# Altium project esp32_c6_a1.PrjPcb
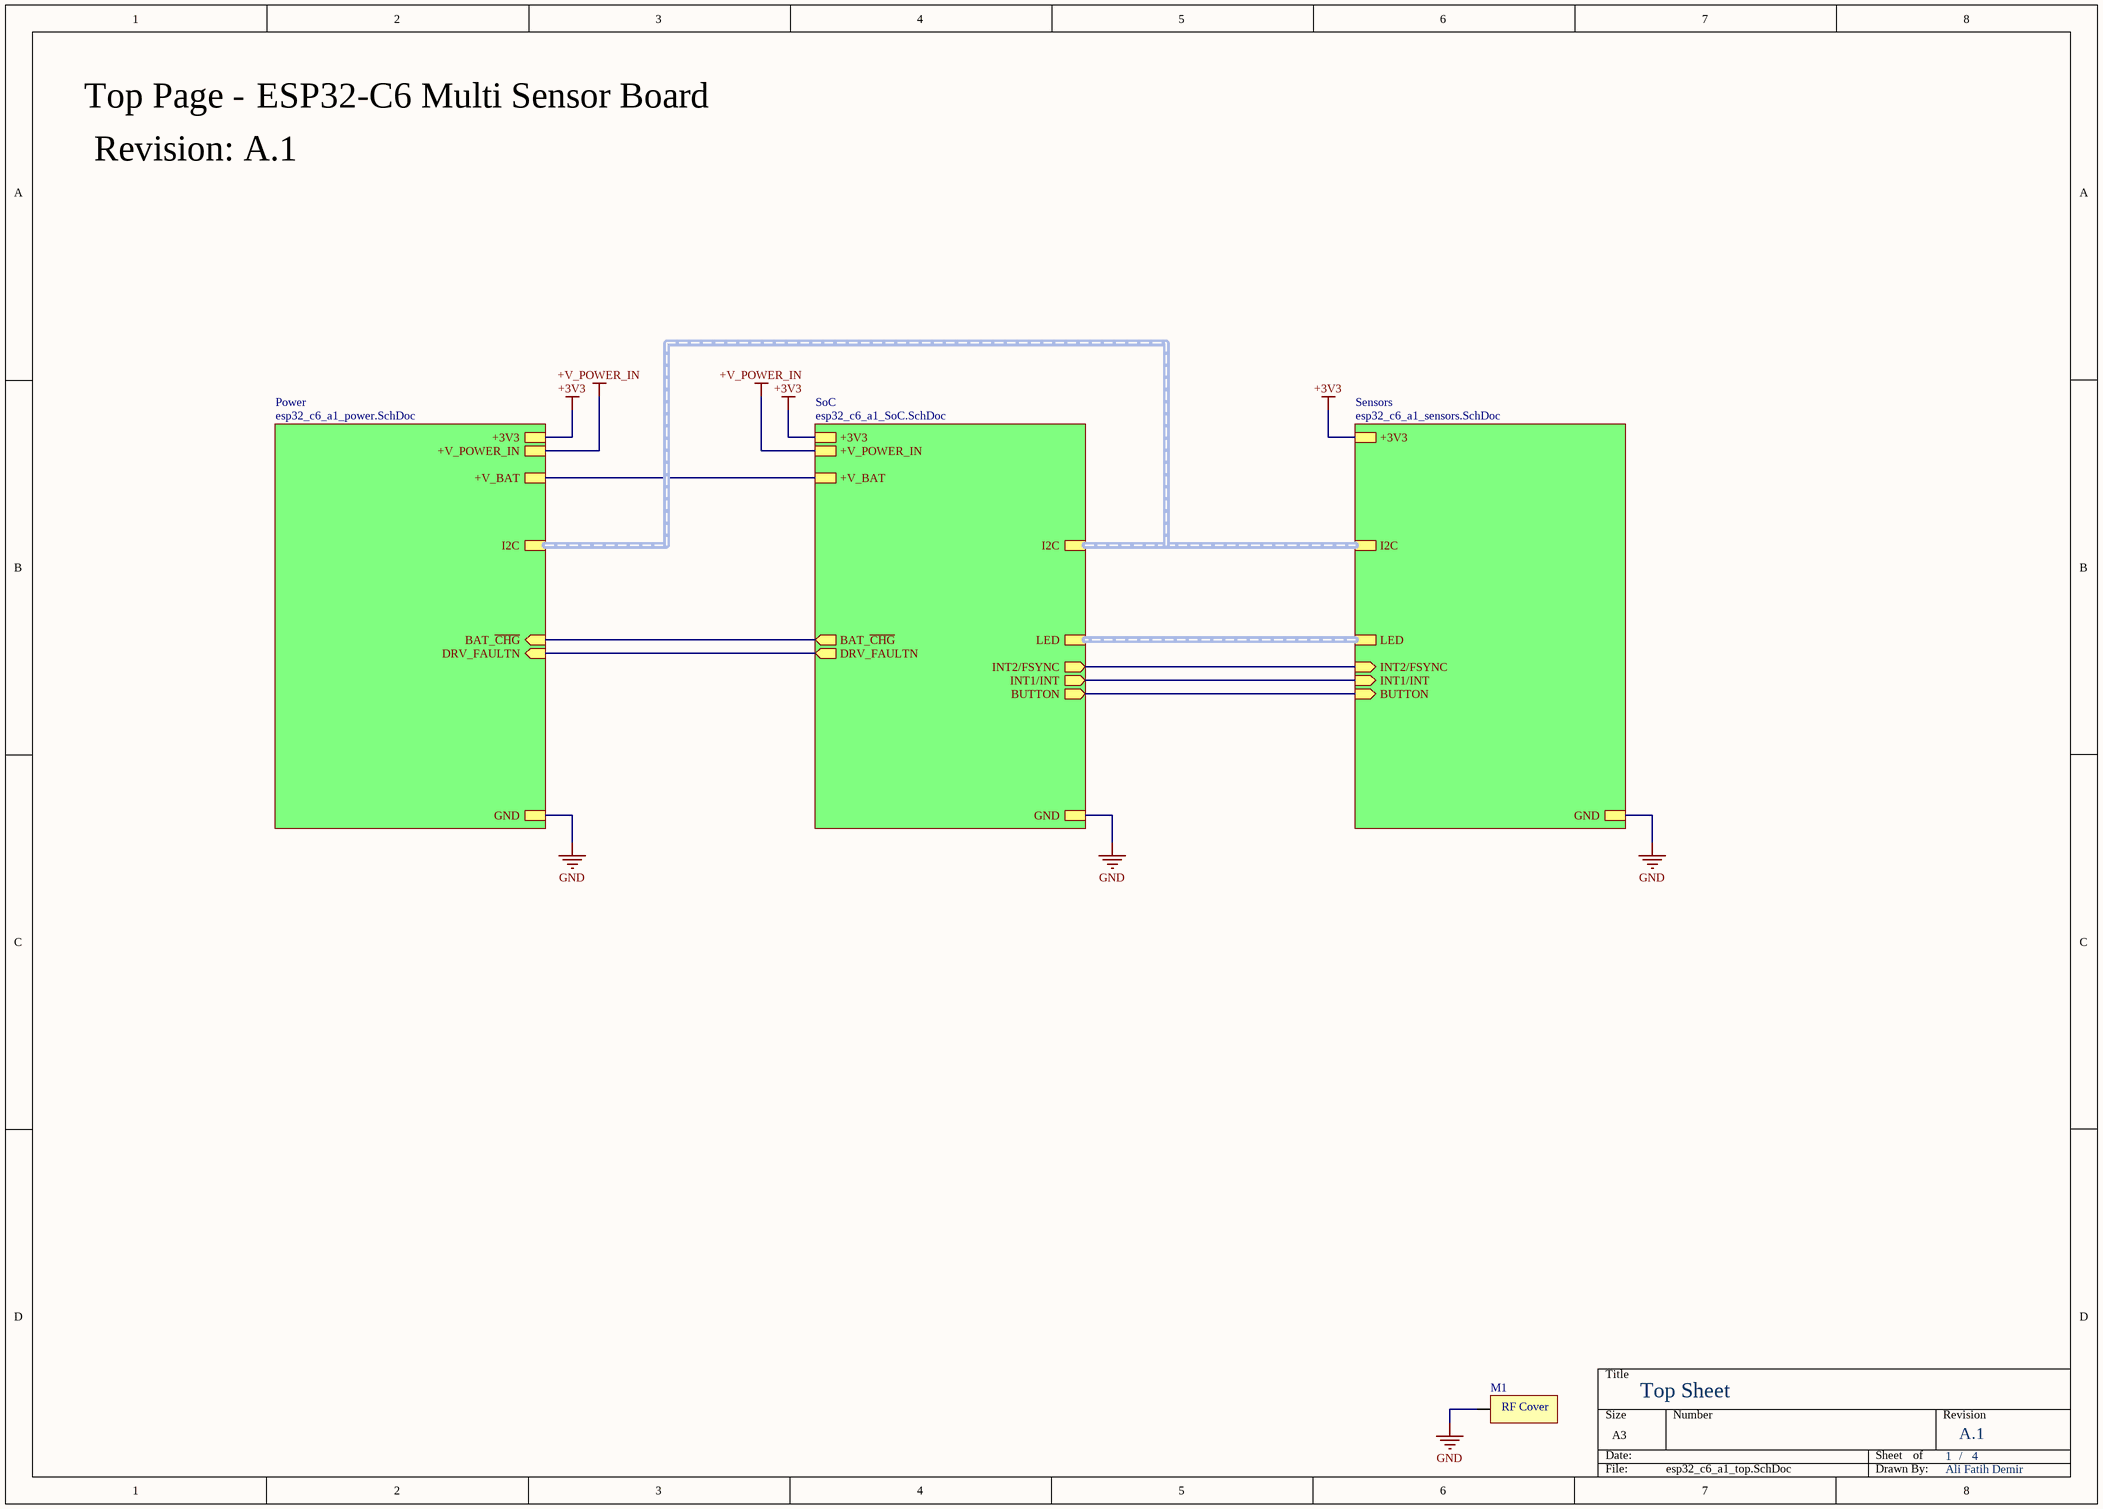
[diagram p0: esp32_c6_a1_top.SchDoc]
pcb_designer: Ali Fatih Demir; project_title: ESP32-C6 Multi Sensor Board; Revision: A.1; sch_designer: Ali Fatih Demir
4 sheets, 111 parts. Net scope: strictly hierarchical (ports join the sheet entries above them; power ports are local).
Board file: esp32_c6_a1.PcbDoc
Sheets:
  esp32_c6_a1_top.SchDoc
    SoC = esp32_c6_a1_SoC.SchDoc
    Power = esp32_c6_a1_power.SchDoc
    Sensors = esp32_c6_a1_sensors.SchDoc

## Sheet esp32_c6_a1_top.SchDoc: Top Sheet
size A3; DrawnBy: Ali Fatih Demir; SheetNumber: 1; SheetTotal: 4

### Parts
M1  RF_COVER  [rf-cover]  (value not drawn)

### Sub-sheets
Power = esp32_c6_a1_power.SchDoc: I2C (harness I2C), +V_BAT, GND, BAT_~{CHG} (in), DRV_FAULTN (in), +3V3, +V_POWER_IN
Sensors = esp32_c6_a1_sensors.SchDoc: +3V3, I2C (harness I2C), GND, LED (harness LED), INT2/FSYNC (in), INT1/INT (in), BUTTON (in)
SoC = esp32_c6_a1_SoC.SchDoc: +V_BAT, GND, BAT_~{CHG} (out), DRV_FAULTN (out), +3V3, LED (harness LED), INT2/FSYNC (out), INT1/INT (out), BUTTON (out), I2C (harness I2C), +V_POWER_IN

### Nets
+3V3: sheet SoC/+3V3, sheet Power/+3V3, sheet Sensors/+3V3
+V_BAT: sheet SoC/+V_BAT, sheet Power/+V_BAT
+V_POWER_IN: sheet SoC/+V_POWER_IN, sheet Power/+V_POWER_IN
GND: M1.MH0(MH) ; sheet SoC/GND, sheet Power/GND, sheet Sensors/GND
BAT_~{CHG}: sheet SoC/BAT_~{CHG}, sheet Power/BAT_~{CHG}
BUTTON: sheet SoC/BUTTON, sheet Sensors/BUTTON
DRV_FAULTN: sheet SoC/DRV_FAULTN, sheet Power/DRV_FAULTN
ICM_INT1/INT: sheet SoC/INT1/INT, sheet Sensors/INT1/INT
ICM_INT2/FSYNC: sheet SoC/INT2/FSYNC, sheet Sensors/INT2/FSYNC

### Buses and harness runs
harness sheet Power/I2C = sheet Sensors/I2C = sheet SoC/I2C
harness sheet Sensors/LED = sheet SoC/LED

### Notes on the sheet
- Top Page -
- Revision:
- /

### Library data of the parts
M1 = RF_COVER: RF Cover; pin to pad: MH0>MH0+MH1+MH2+MH3+MH4; Manufacturer: TBD; MPN: TBD

## Sheet esp32_c6_a1_SoC.SchDoc
size A3; SheetNumber: 2; SheetTotal: 4
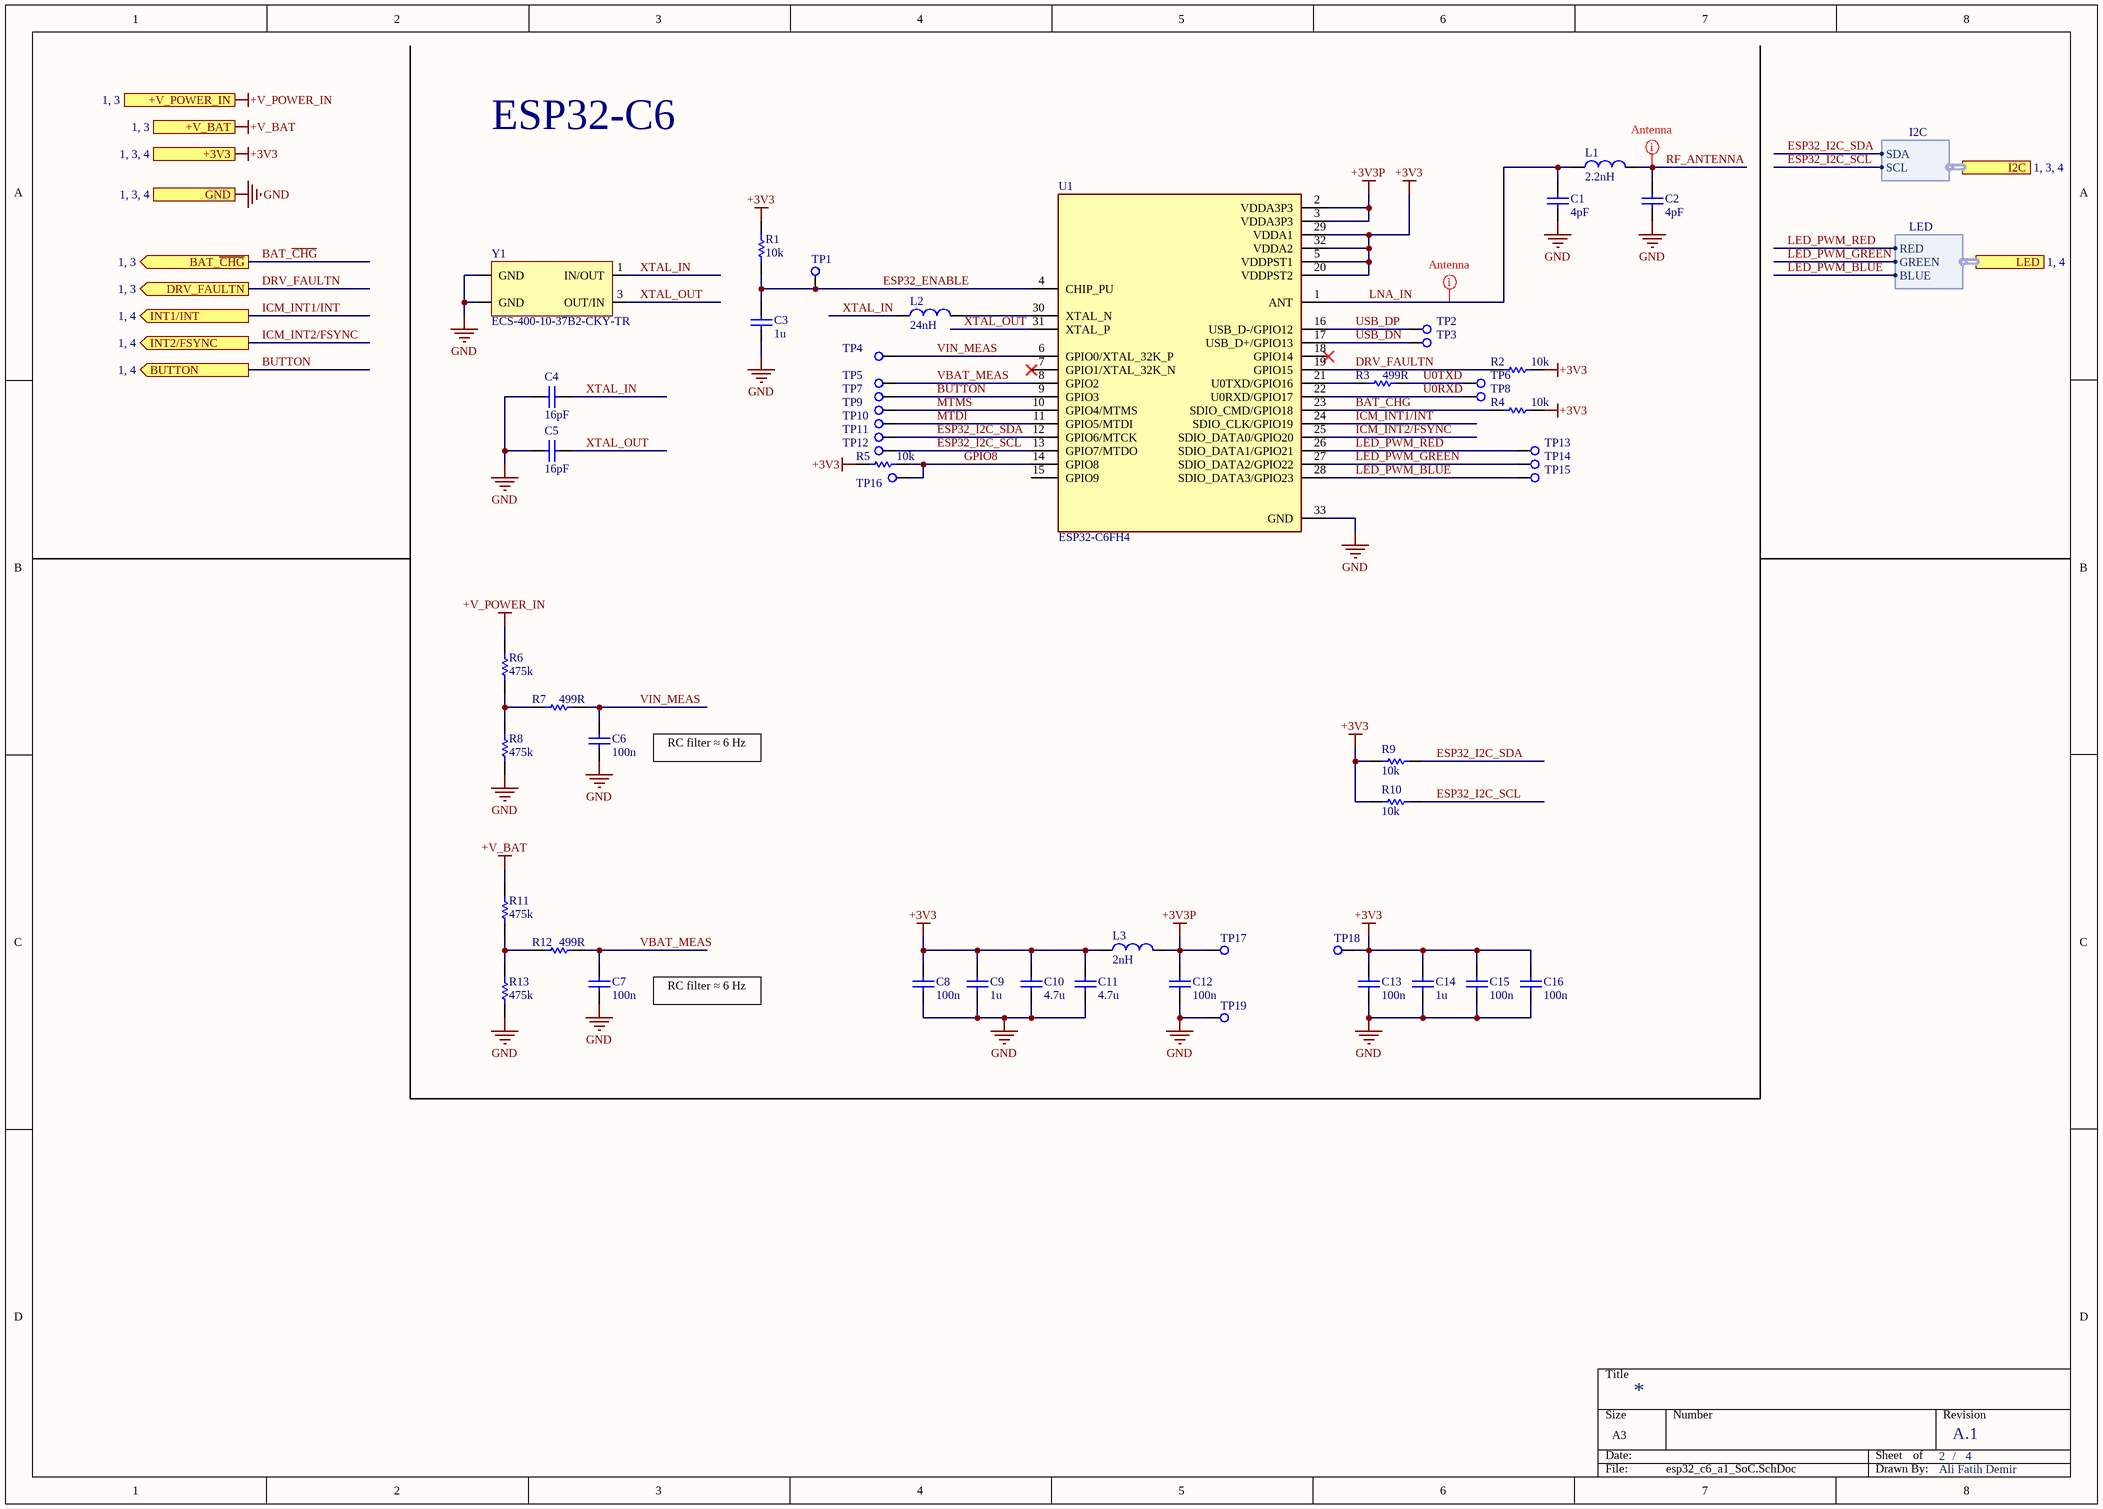
[diagram p1: esp32_c6_a1_SoC.SchDoc]

### Parts
C1  value 4pF  [C_0201]  (hidden comment: 0201)
C2  value 4pF  [C_0201]  (hidden comment: 0201)
C3  value 1u  [C_0603]  (hidden comment: 0603)
C4  value 16pF  [C_0402]  (hidden comment: 0402)
C5  value 16pF  [C_0402]  (hidden comment: 0402)
C6  value 100n  [C_0402]  (hidden comment: 0402)
C7  value 100n  [C_0402]  (hidden comment: 0402)
C8  value 100n  [C_0402]  (hidden comment: 0402)
C9  value 1u  [C_0603]  (hidden comment: 0603)
C10  value 4.7u  [C_0603]  (hidden comment: 0603)
C11  value 4.7u  [C_0603]  (hidden comment: 0603)
C12  value 100n  [C_0402]  (hidden comment: 0402)
C13  value 100n  [C_0402]  (hidden comment: 0402)
C14  value 1u  [C_0603]  (hidden comment: 0603)
C15  value 100n  [C_0402]  (hidden comment: 0402)
C16  value 100n  [C_0402]  (hidden comment: 0402)
L1  value 2.2nH  [L_0201]  (hidden comment: 0201)
L2  value 24nH  [L_0201]  (hidden comment: 0201)
L3  value 2nH  [L_0402]  (hidden comment: 0402)
R1  value 10k  [R_0402]  (hidden comment: 0402)
R2  value 10k  [R_0402]  (hidden comment: 0402)
R3  value 499R  [R_0402]  (hidden comment: 0402)
R4  value 10k  [R_0402]  (hidden comment: 0402)
R5  value 10k  [R_0402]  (hidden comment: 0402)
R6  value 475k  [R_0402]  (hidden comment: 0402)
R7  value 499R  [R_0402]  (hidden comment: 0402)
R8  value 475k  [R_0402]  (hidden comment: 0402)
R9  value 10k  [R_0402]  (hidden comment: 0402)
R10  value 10k  [R_0402]  (hidden comment: 0402)
R11  value 475k  [R_0402]  (hidden comment: 0402)
R12  value 499R  [R_0402]  (hidden comment: 0402)
R13  value 475k  [R_0402]  (hidden comment: 0402)
TP1  TP  [tp_round_80]  (value not drawn)  (no BOM)
TP2  TP  [tp_round_80]  (value not drawn)  (no BOM)
TP3  TP  [tp_round_80]  (value not drawn)  (no BOM)
TP4  TP  [tp_round_80]  (value not drawn)  (no BOM)
TP5  TP  [tp_round_80]  (value not drawn)  (no BOM)
TP6  TP  [tp_round_80]  (value not drawn)  (no BOM)
TP7  TP  [tp_round_80]  (value not drawn)  (no BOM)
TP8  TP  [tp_round_80]  (value not drawn)  (no BOM)
TP9  TP  [tp_round_80]  (value not drawn)  (no BOM)
TP10  TP  [tp_round_80]  (value not drawn)  (no BOM)
TP11  TP  [tp_round_80]  (value not drawn)  (no BOM)
TP12  TP  [tp_round_80]  (value not drawn)  (no BOM)
TP13  TP  [tp_round_80]  (value not drawn)  (no BOM)
TP14  TP  [tp_round_80]  (value not drawn)  (no BOM)
TP15  TP  [tp_round_80]  (value not drawn)  (no BOM)
TP16  TP  [tp_round_80]  (value not drawn)  (no BOM)
TP17  TP  [tp_round_80]  (value not drawn)  (no BOM)
TP18  TP  [tp_round_80]  (value not drawn)  (no BOM)
TP19  TP  [tp_round_80]  (value not drawn)  (no BOM)
U1  ESP32-C6FH4  [QFN50P500X500X90-33N]
Y1  ECS-400-10-37B2-CKY-TR  [XTAL_ECS-400-10-37B2-CKY-TR]

### Ports
+3V3 (see 1, 3, 4), +V_BAT (see 1, 3), +V_POWER_IN (see 1, 3), BAT_~{CHG} (out, see 1, 3), BUTTON (out, see 1, 4), DRV_FAULTN (out, see 1, 3), GND (see 1, 3, 4), I2C (harness I2C, see 1, 3, 4), INT1/INT (out, see 1, 4), INT2/FSYNC (out, see 1, 4), LED (harness LED, see 1, 4)

### Harnesses
I2C: SDA, SCL
LED: RED, GREEN, BLUE

### Nets
+3V3: C8.2 C9.2 C10.2 C11.2 C13.2 C14.2 C15.2 C16.2 L3.1 R1.2 R2.2 R4.2 R5.1 R9.2 R10.2 TP18.1 U1.5(VDDPST1) U1.20(VDDPST2) U1.29(VDDA1) U1.32(VDDA2) ; port +3V3
+3V3P: C12.2 L3.2 TP17.1 U1.2(VDDA3P3) U1.3(VDDA3P3)
+V_BAT: R11.2 ; port +V_BAT
+V_POWER_IN: R6.2 ; port +V_POWER_IN
GND: C1.1 C2.1 C3.1 C4.2 C5.2 C6.1 C7.1 C8.1 C9.1 C10.1 C11.1 C12.1 C13.1 C14.1 C15.1 C16.1 R8.1 R13.1 TP19.1 U1.33(GND) Y1.2(GND) Y1.4(GND) ; port GND
BAT_~{CHG}: R4.1 U1.23(SDIO_CMD/GPIO18) ; port BAT_~{CHG}
BUTTON: TP7.1 U1.9(GPIO3) ; port BUTTON
DRV_FAULTN: R2.1 U1.19(GPIO15) ; port DRV_FAULTN
ESP32_ENABLE: C3.2 R1.1 TP1.1 U1.4(CHIP_PU)
ESP32_I2C_SCL: R10.1 TP12.1 U1.13(GPIO7/MTDO) ; port I2C.SCL
ESP32_I2C_SDA: R9.1 TP11.1 U1.12(GPIO6/MTCK) ; port I2C.SDA
GPIO8: R5.2 TP16.1 U1.14(GPIO8)
ICM_INT1/INT: U1.24(SDIO_CLK/GPIO19) ; port INT1/INT
ICM_INT2/FSYNC: U1.25(SDIO_DATA0/GPIO20) ; port INT2/FSYNC
LED_PWM_BLUE: TP15.1 U1.28(SDIO_DATA3/GPIO23) ; port LED.BLUE
LED_PWM_GREEN: TP14.1 U1.27(SDIO_DATA2/GPIO22) ; port LED.GREEN
LED_PWM_RED: TP13.1 U1.26(SDIO_DATA1/GPIO21) ; port LED.RED
LNA_IN: C1.2 L1.1 U1.1(ANT)
MTDI: TP10.1 U1.11(GPIO5/MTDI)
MTMS: TP9.1 U1.10(GPIO4/MTMS)
RF_ANTENNA: C2.2 L1.2
U0RXD: TP8.1 U1.22(U0RXD/GPIO17)
U0TXD: R3.2 TP6.1
USB_DN: TP3.1 U1.17(USB_D+/GPIO13)
USB_DP: TP2.1 U1.16(USB_D-/GPIO12)
VBAT_MEAS: C7.2 R12.2 TP5.1 U1.8(GPIO2)
VIN_MEAS: C6.2 R7.2 TP4.1 U1.6(GPIO0/XTAL_32K_P)
XTAL_IN: C4.1 L2.1 Y1.1(IN/OUT)
XTAL_OUT: C5.1 U1.31(XTAL_P) Y1.3(OUT/IN)
NetL2_2: L2.2 U1.30(XTAL_N)
NetR3_1: R3.1 U1.21(U0TXD/GPIO16)
NetR6_1: R6.1 R7.1 R8.2
NetR11_1: R11.1 R12.1 R13.2

Not connected (* = marked no-connect by the designer): U1 7(GPIO1/XTAL_32K_N)* 15(GPIO9) 18(GPIO14)*

### Layout directives
net class Antenna: LNA_IN, RF_ANTENNA

### Notes on the sheet
- ESP32-C6
- The crystal should operate flawlessly to maximize RF performance. Please verify this again using Espressif's test software.
- RC filter ≈ 6 Hz
- /

### Library data of the parts
C1 C2 = C_0201: SMD 0201 Ceramic Chip Capacitor; Manufacturer: Murata; MPN: GRM0335C1H4R0BA01D; Cad Data: ?; Part Number: ?; List Code: ?
C3 C9 C14 = C_0603: SMD 0603 Ceramic Chip Capacitor; Manufacturer: Samsung; MPN: CL10B105KP8NNNC; Cad Data: ?; Part Number: ?; List Code: ?
C4 C5 = C_0402: SMD 0402 Ceramic Chip Capacitor; Manufacturer: Murata; MPN: GJM1555C1H160FB01J; Cad Data: ?; Part Number: ?; List Code: ?
C6-C8 C12 C13 C15 C16 = C_0402: SMD 0402 Ceramic Chip Capacitor; Manufacturer: Samsung; MPN: CL05B104KP5NNNC; Cad Data: ?; Part Number: ?; List Code: ?
C10 C11 = C_0603: SMD 0603 Ceramic Chip Capacitor; Manufacturer: Samsung; MPN: CL10A475KP8NNNC; Cad Data: ?; Part Number: ?; List Code: ?
L1 = L_0201: SMD 0201 Inductor; Manufacturer: Murata; MPN: LQP03TN2N2B02D; Cad Data: ?; Part Number: ?; List Code: ?
L2 = L_0201: SMD 0201 Inductor; Manufacturer: Murata; MPN: LQP03TN24NH02D; Cad Data: ?; Part Number: ?; List Code: ?
L3 = L_0402: SMD 0402 Inductor; Manufacturer: Murata; MPN: LQG15HN2N0C02D; Cad Data: ?; Part Number: ?; List Code: ?
R1 R2 R4 R5 R9 R10 = R_0402: SMD 0402 Rectangular Thick Film Chip Resistor; Manufacturer: Yageo; MPN: RC0402FR-0710KL; Cad Data: ?; Part Number: ?; List Code: ?
R3 R7 R12 = R_0402: SMD 0402 Rectangular Thick Film Chip Resistor; Manufacturer: Yageo; MPN: RC0402FR-07499RL; Cad Data: ?; Part Number: ?; List Code: ?
R6 R8 R11 R13 = R_0402: SMD 0402 Rectangular Thick Film Chip Resistor; Manufacturer: Yageo; MPN: RC0402FR-07475KL; Cad Data: ?; Part Number: ?; List Code: ?
TP1-TP19 = TP: Test Point
U1 = ESP32-C6FH4: 802.15.4, Bluetooth, WiFi 802.11ax, Bluetooth v5.0, ZigbeeÂ® Transceiver Module 2.4GHz Antenna Not Included Surface Mount; Manufacturer: Espressif Systems; Package: None; Price: None; Check_prices: https://www.snapeda.com/parts/ESP32-C6FH4/Espressif+Systems/view-part/?ref=eda; Value: *; SnapEDA_Link: https://www.snapeda.com/parts/ESP32-C6FH4/Espressif+Systems/view-part/?ref=snap; MPN: ESP32-C6FH4; Availability: In Stock; Purchase-URL: https://pricing.snapeda.com/search?q=ESP32-C6FH4&ref=eda
Y1 = ECS-400-10-37B2-CKY-TR: 40 MHz Â±10ppm Crystal 10pF 40 Ohms 4-SMD, No Lead; Manufacturer: ECS Inc.; MPN: ECS-400-10-37B2-CKY-TR; Package: None; Digi-Key_Part_Number: 50-ECS-400-10-37B2-CKY-TR-ND; Check_prices: https://www.snapeda.com/parts/ECS-400-10-37B2-CKY-TR/ECS+Inc./view-part/?ref=eda; Purchase-URL: https://pricing.snapeda.com/search/part/ECS-400-10-37B2-CKY-TR/?ref=eda; SnapEDA_Link: https://www.snapeda.com/parts/ECS-400-10-37B2-CKY-TR/ECS+Inc./view-part/?ref=snap; Value: *

## Sheet esp32_c6_a1_power.SchDoc: Power
size A3; SheetNumber: 3; SheetTotal: 4
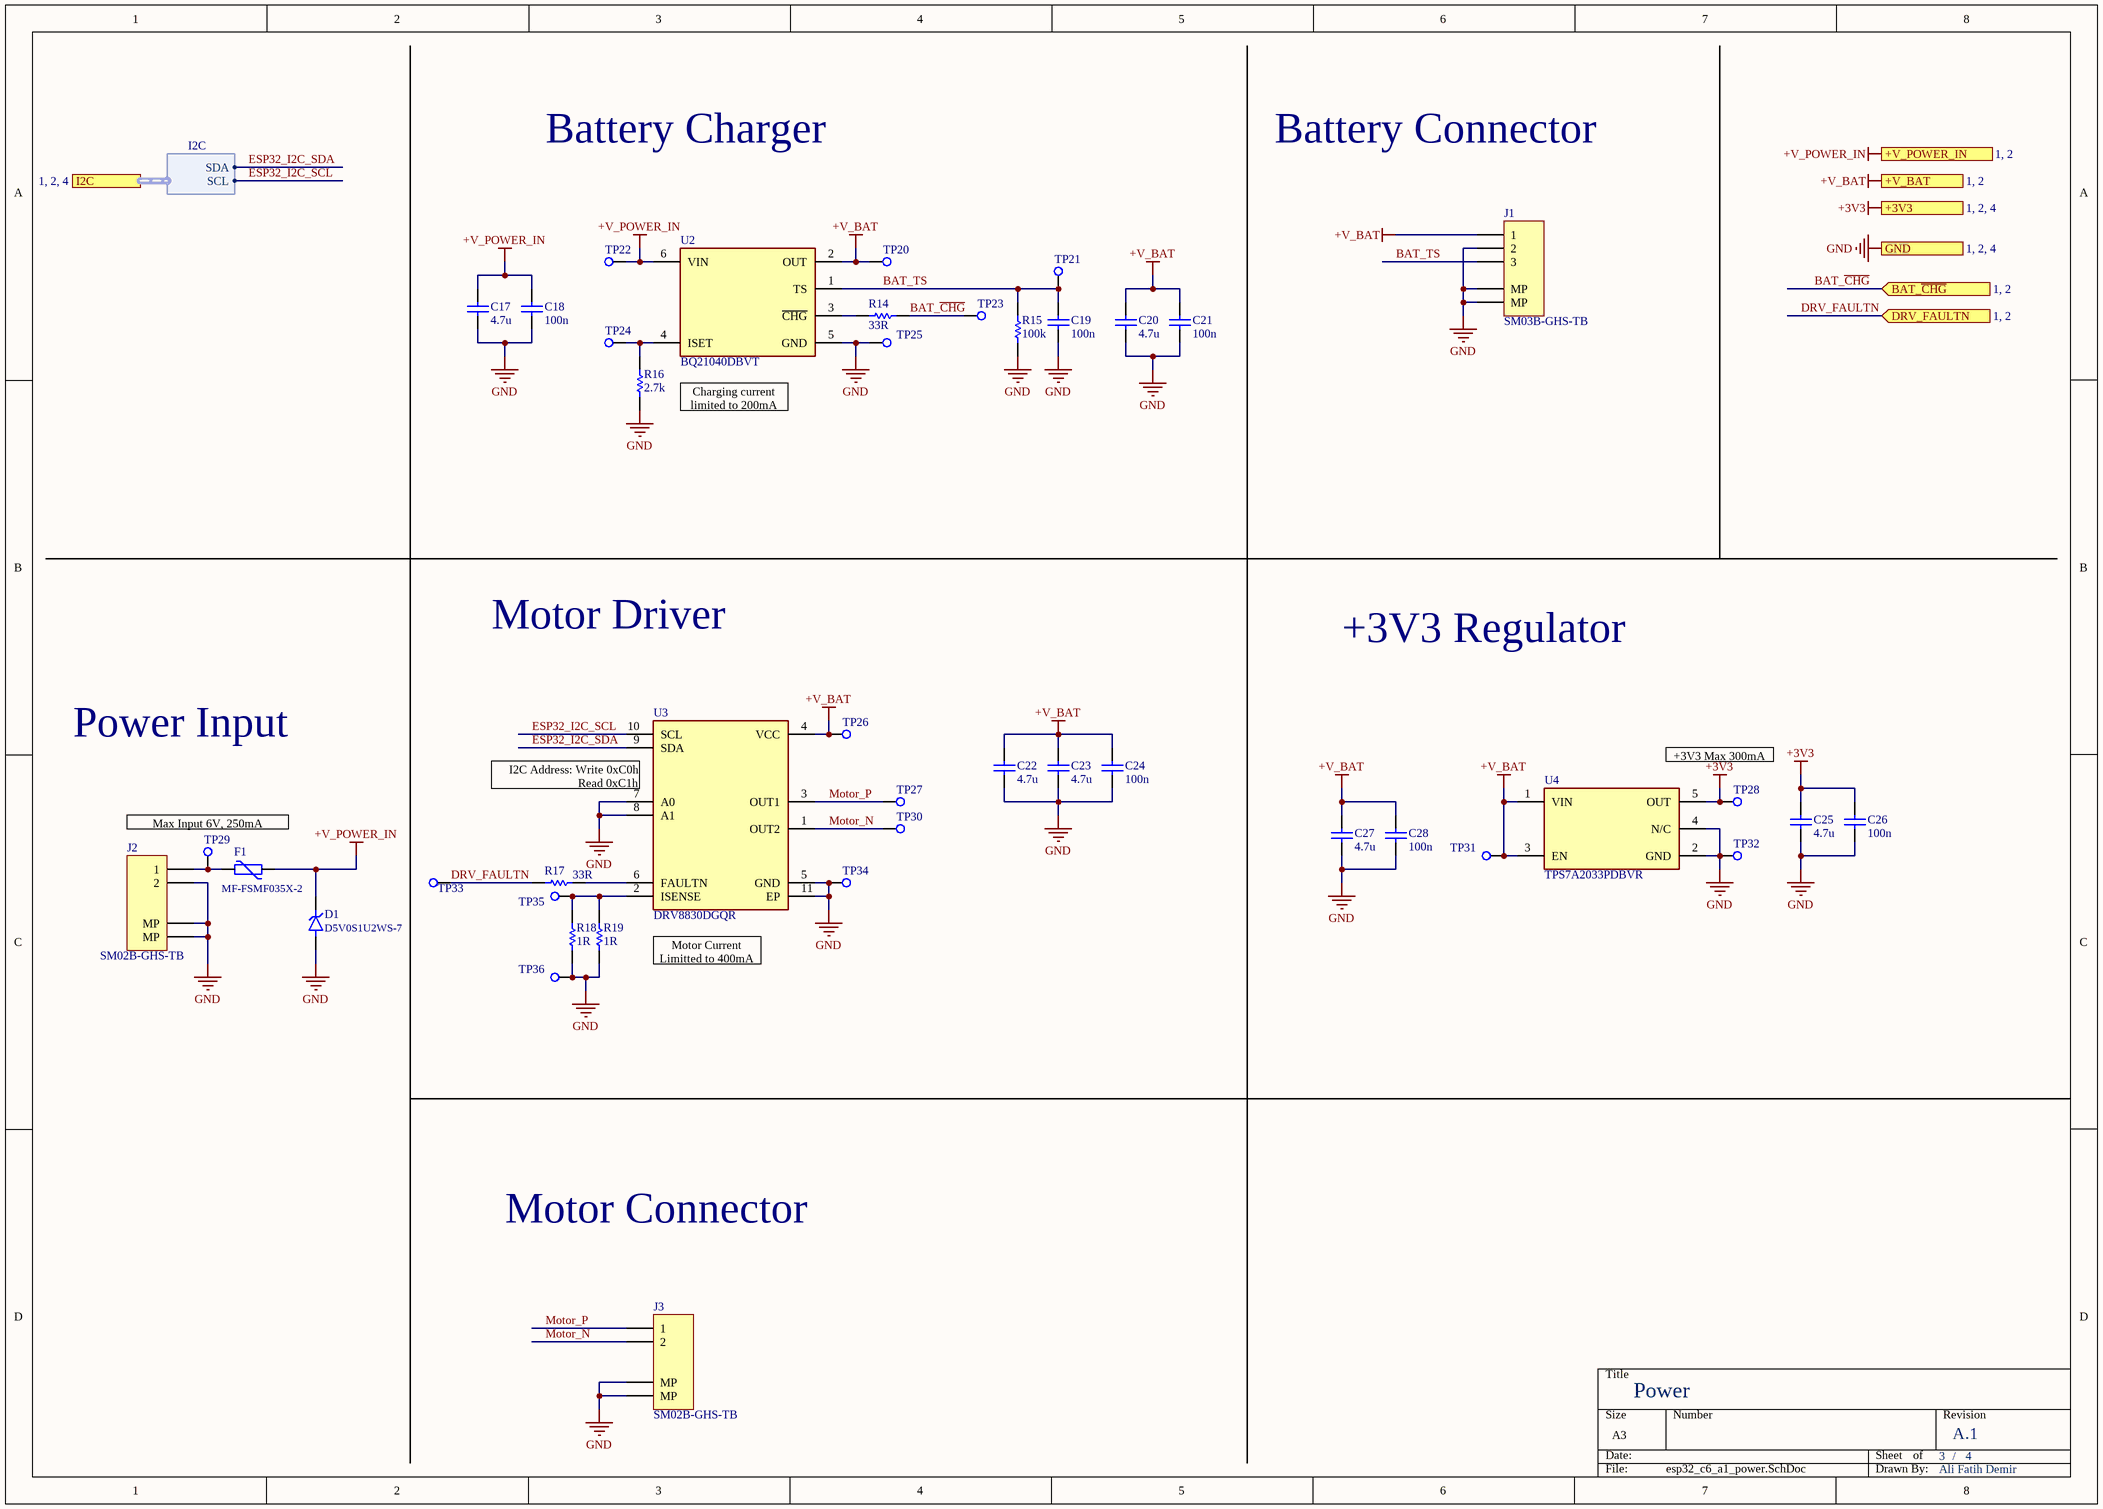
[diagram p2: esp32_c6_a1_power.SchDoc]

### Parts
C17  value 4.7u  [C_0603]  (hidden comment: 0603)
C18  value 100n  [C_0402]  (hidden comment: 0402)
C19  value 100n  [C_0402]  (hidden comment: 0402)
C20  value 4.7u  [C_0603]  (hidden comment: 0603)
C21  value 100n  [C_0402]  (hidden comment: 0402)
C22  value 4.7u  [C_0603]  (hidden comment: 0603)
C23  value 4.7u  [C_0603]  (hidden comment: 0603)
C24  value 100n  [C_0402]  (hidden comment: 0402)
C25  value 4.7u  [C_0603]  (hidden comment: 0603)
C26  value 100n  [C_0402]  (hidden comment: 0402)
C27  value 4.7u  [C_0603]  (hidden comment: 0603)
C28  value 100n  [C_0402]  (hidden comment: 0402)
D1  D5V0S1U2WS-7  [SOD2513X120N]
F1  MF-FSMF035X-2  [0603-F1608X100N]
J1  SM03B-GHS-TB  [jst_sm03b-ghs-tb]
J2  SM02B-GHS-TB  [JST-SM02B-GHS-TB]
J3  SM02B-GHS-TB  [JST-SM02B-GHS-TB]
R14  value 33R  [R_0402]  (hidden comment: 0402)
R15  value 100k  [R_0402]  (hidden comment: 0402)
R16  value 2.7k  [R_0402]  (hidden comment: 0402)
R17  value 33R  [R_0402]  (hidden comment: 0402)
R18  value 1R  [R_0603]  (hidden comment: 0603)
R19  value 1R  [R_0603]  (hidden comment: 0603)
TP20  TP  [tp_round_80]  (value not drawn)  (no BOM)
TP21  TP  [tp_round_80]  (value not drawn)  (no BOM)
TP22  TP  [tp_round_80]  (value not drawn)  (no BOM)
TP23  TP  [tp_round_80]  (value not drawn)  (no BOM)
TP24  TP  [tp_round_80]  (value not drawn)  (no BOM)
TP25  TP  [tp_round_80]  (value not drawn)  (no BOM)
TP26  TP  [tp_round_80]  (value not drawn)  (no BOM)
TP27  TP  [tp_round_80]  (value not drawn)  (no BOM)
TP28  TP  [tp_round_80]  (value not drawn)  (no BOM)
TP29  TP  [tp_round_80]  (value not drawn)  (no BOM)
TP30  TP  [tp_round_80]  (value not drawn)  (no BOM)
TP31  TP  [tp_round_80]  (value not drawn)  (no BOM)
TP32  TP  [tp_round_80]  (value not drawn)  (no BOM)
TP33  TP  [tp_round_80]  (value not drawn)  (no BOM)
TP34  TP  [tp_round_80]  (value not drawn)  (no BOM)
TP35  TP  [tp_round_80]  (value not drawn)  (no BOM)
TP36  TP  [tp_round_80]  (value not drawn)  (no BOM)
U2  BQ21040DBVT  [SOT95P280X110-6N]
U3  DRV8830DGQR  [IC_XTR111AIDGQR]
U4  TPS7A2033PDBVR  [SOT95P280X110-5N]

### Ports
+3V3 (see 1, 2, 4), +V_BAT (see 1, 2), +V_POWER_IN (see 1, 2), BAT_~{CHG} (in, see 1, 2), DRV_FAULTN (in, see 1, 2), GND (see 1, 2, 4), I2C (harness I2C, see 1, 2, 4)

### Harnesses
I2C: SDA, SCL

### Nets
+3V3: C25.2 C26.2 TP28.1 U4.5(OUT) ; port +3V3
+V_BAT: C20.2 C21.2 C22.2 C23.2 C24.2 C27.2 C28.2 J1.1 TP20.1 TP26.1 TP31.1 U2.2(OUT) U3.4(VCC) U4.1(VIN) U4.3(EN) ; port +V_BAT
+V_POWER_IN: C17.2 C18.2 D1.1 F1.1 TP22.1 U2.6(VIN) ; port +V_POWER_IN
GND: C17.1 C18.1 C19.1 C20.1 C21.1 C22.1 C23.1 C24.1 C25.1 C26.1 C27.1 C28.1 D1.2 J1.2 J1.MP1(MP) J1.MP2(MP) J2.2 J2.MP1(MP) J2.MP2(MP) J3.MP1(MP) J3.MP2(MP) R15.2 R16.2 R18.1 R19.1 TP25.1 TP32.1 TP34.1 TP36.1 U2.5(GND) U3.5(GND) U3.7(A0) U3.8(A1) U3.11(EP) U4.2(GND) U4.4(N/C) ; port GND
BAT_~{CHG}: R14.1 TP23.1 ; port BAT_~{CHG}
BAT_TS: C19.2 J1.3 R15.1 TP21.1 U2.1(TS)
DRV_FAULTN: R17.2 TP33.1 ; port DRV_FAULTN
ESP32_I2C_SCL: U3.10(SCL) ; port I2C.SCL
ESP32_I2C_SDA: U3.9(SDA) ; port I2C.SDA
Motor_N: J3.2 TP30.1 U3.1(OUT2)
Motor_P: J3.1 TP27.1 U3.3(OUT1)
NetF1_2: F1.2 J2.1 TP29.1
NetR14_2: R14.2 U2.3(~{CHG})
NetR16_1: R16.1 TP24.1 U2.4(ISET)
NetR17_1: R17.1 U3.6(FAULTN)
NetR18_2: R18.2 R19.2 TP35.1 U3.2(ISENSE)

### Notes on the sheet
- Battery Charger
- Battery Connector
- Charging current limited to 200mA
- Motor Driver
- +3V3 Regulator
- Power Input
- (near U3) I2C Address: Write 0xC0h Read 0xC1h
- +3V3 Max 300mA
- Max Input 6V, 250mA
- Motor Current Limitted to 400mA
- Motor Connector
- /

### Library data of the parts
C17 C20 C22 C23 C25 C27 = C_0603: as C10 on sheet esp32_c6_a1_SoC; Cad Data: ?; Part Number: ?; List Code: ?
C18 C19 C21 C24 C26 C28 = C_0402: as C6 on sheet esp32_c6_a1_SoC; Cad Data: ?; Part Number: ?; List Code: ?
D1 = D5V0S1U2WS-7: 16V Clamp 70A (8/20µs) Ipp Tvs Diode Surface Mount SOD-323; Manufacturer: Diodes; MPN: BZV55C4V7-TP; Value: *
F1 = MF-FSMF035X-2: Polymeric PTC Resettable Fuse 6V 350mA Ih Surface Mount 0603 _1608 Metric_, Concave; Manufacturer: Bourns; Package: 0603 Bourns; MPN: MF-FSMF035X-2; Price: None; Value: *
J1 = SM03B-GHS-TB: CONN HEADER SMD 3POS 1.25MM; Manufacturer: JST; MPN: SM03B-GHS-TB
J2 J3 = SM02B-GHS-TB: CONN HEADER SMD 2POS 1.25MM; Manufacturer: JST; MPN: SM02B-GHS-TB
R14 R17 = R_0402: SMD 0402 Rectangular Thick Film Chip Resistor; Manufacturer: Yageo; MPN: RC0402FR-0733RL; Cad Data: ?; Part Number: ?; List Code: ?
R15 = R_0402: as R1 on sheet esp32_c6_a1_SoC; Cad Data: ?; Part Number: ?; List Code: ?
R16 = R_0402: SMD 0402 Rectangular Thick Film Chip Resistor; Manufacturer: Yageo; MPN: RC0402FR-072K7L; Cad Data: ?; Part Number: ?; List Code: ?
R18 R19 = R_0603: SMD 0603 Rectangular Thick Film Chip Resistor; Manufacturer: Yageo; MPN: RC0603FR-071RL; Cad Data: ?; Part Number: ?
TP20-TP36 = TP: Test Point
U2 = BQ21040DBVT: 1-cell, 0.8-A Li-ion and Li-polymerymer battery charger 6-SOT-23 0 to 125; MF: Texas Instruments; Value: *; SnapEDA_Link: https://www.snapeda.com/parts/BQ21040DBVT/Texas%20Instruments/view-part/1216215/?ref=snap; Texas_Instruments-Purchase-URL: https://snapeda.com/shop?store=Texas+Instruments&id=1216215; Mouser-Purchase-URL: https://snapeda.com/shop?store=Mouser&id=1216215; Digi-Key_Part_Number: 296-44196-1-ND; DigiKey-Purchase-URL: https://snapeda.com/shop?store=DigiKey&id=1216215; Package: SOT-23-6 Texas Instruments; Manufacturer: BQ21040DBVT; MPN: BQ21040DBVT
U3 = DRV8830DGQR: 6.8-V, 1-A H-bridge motor driver with speed regulation and i2c control 10-HVSSOP -40 to 85; Manufacturer: Texas Instruments; Package: HVSSOP-10 Texas Instruments; Check_prices: https://www.snapeda.com/parts/DRV8830DGQR/Texas%20Instruments/view-part/552464/?ref=eda; Price: None; SnapEDA_Link: https://www.snapeda.com/parts/DRV8830DGQR/Texas%20Instruments/view-part/552464/?ref=snap; Value: *; MPN: DRV8830DGQR; Purchase-URL: https://pricing.snapeda.com/search/part/DRV8830DGQR/?ref=eda; Availability: Good
U4 = TPS7A2033PDBVR: Linear Voltage Regulator IC Positive Fixed 1 Output 300mA SOT-23-5; Manufacturer: Texas Instruments; Value: *; MPN: TPS7A2033PDBVR

## Sheet esp32_c6_a1_sensors.SchDoc: Sensors
size A3; SheetNumber: 4; SheetTotal: 4
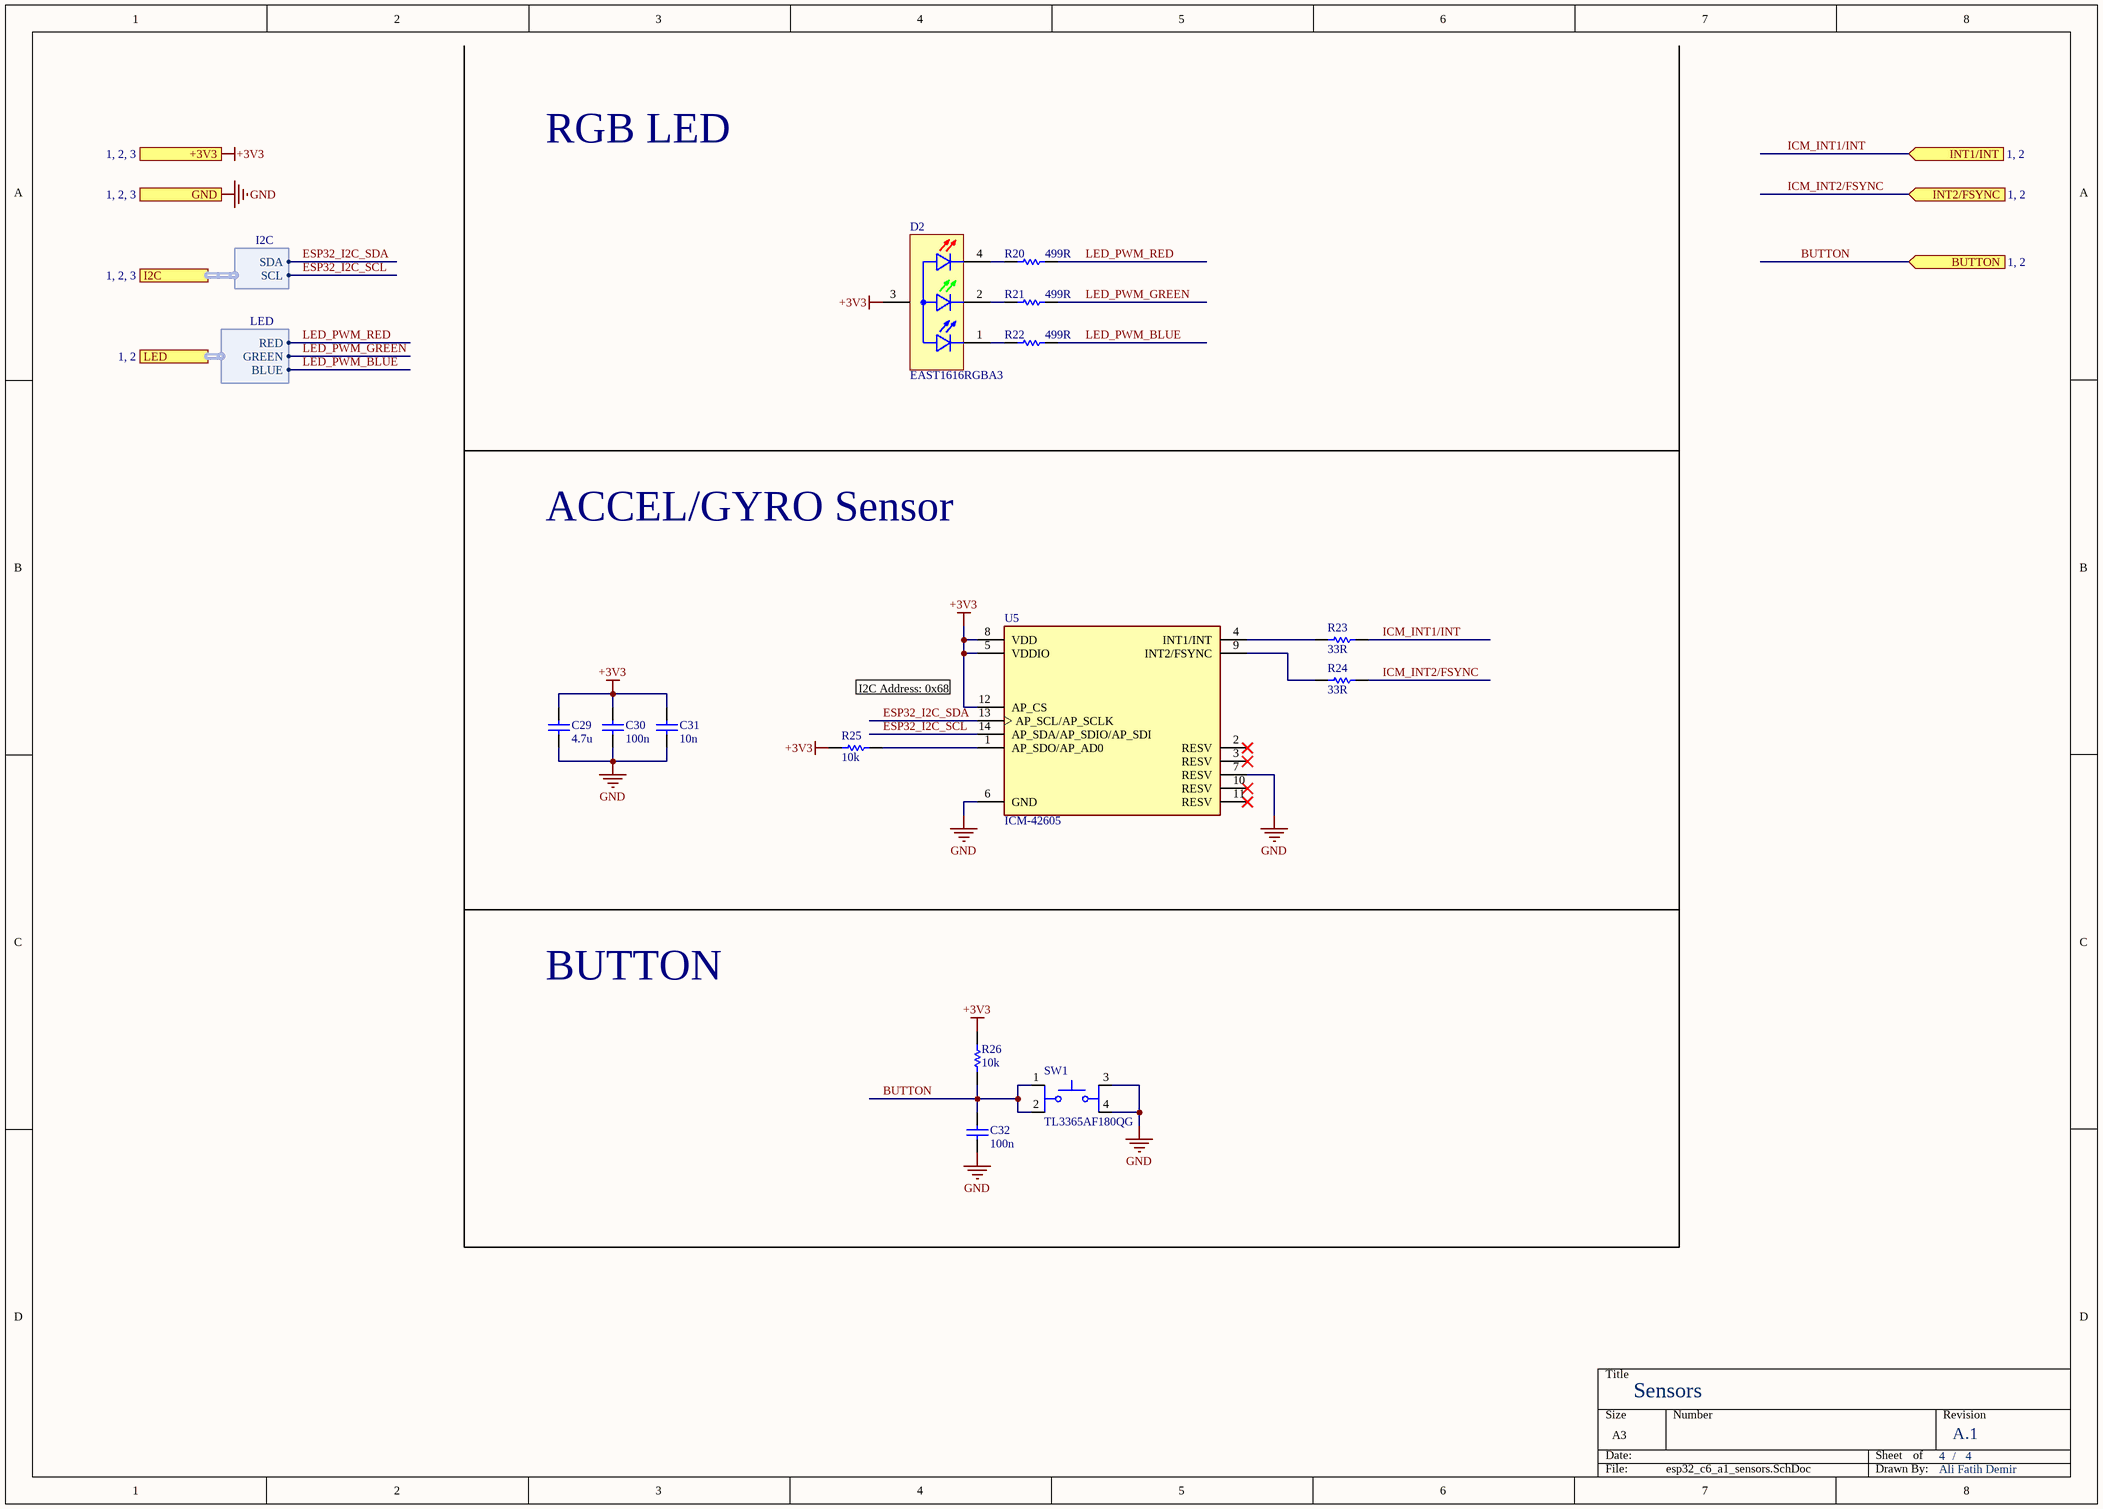
[diagram p3: esp32_c6_a1_sensors.SchDoc]

### Parts
C29  value 4.7u  [C_0603]  (hidden comment: 0603)
C30  value 100n  [C_0402]  (hidden comment: 0402)
C31  value 10n  [C_0402]  (hidden comment: 0402)
C32  value 100n  [C_0402]  (hidden comment: 0402)
D2  EAST1616RGBA3  [LED_EAST1616RGBA3]
R20  value 499R  [R_0402]  (hidden comment: 0402)
R21  value 499R  [R_0402]  (hidden comment: 0402)
R22  value 499R  [R_0402]  (hidden comment: 0402)
R23  value 33R  [R_0402]  (hidden comment: 0402)
R24  value 33R  [R_0402]  (hidden comment: 0402)
R25  value 10k  [R_0402]  (hidden comment: 0402)
R26  value 10k  [R_0402]  (hidden comment: 0402)
SW1  TL3365AF180QG  [SW_TL3365AF180QG]
U5  ICM-42605  [XDCR_ICM-42605]

### Ports
+3V3 (see 1, 2, 3), BUTTON (in, see 1, 2), GND (see 1, 2, 3), I2C (harness I2C, see 1, 2, 3), INT1/INT (in, see 1, 2), INT2/FSYNC (in, see 1, 2), LED (harness LED, see 1, 2)

### Harnesses
I2C: SDA, SCL
LED: RED, GREEN, BLUE

### Nets
+3V3: C29.2 C30.1 C31.1 D2.3(A) R25.2 R26.1 U5.5(VDDIO) U5.8(VDD) U5.12(AP_CS) ; port +3V3
GND: C29.1 C30.2 C31.2 C32.2 SW1.3 SW1.4 U5.6(GND) U5.7(RESV) ; port GND
BUTTON: C32.1 R26.2 SW1.1 SW1.2 ; port BUTTON
ESP32_I2C_SCL: U5.14(AP_SDA/AP_SDIO/AP_SDI) ; port I2C.SCL
ESP32_I2C_SDA: U5.13(AP_SCL/AP_SCLK) ; port I2C.SDA
ICM_INT1/INT: R23.1 ; port INT1/INT
ICM_INT2/FSYNC: R24.1 ; port INT2/FSYNC
LED_PWM_BLUE: R22.2 ; port LED.BLUE
LED_PWM_GREEN: R21.2 ; port LED.GREEN
LED_PWM_RED: R20.2 ; port LED.RED
NetD2_1: D2.1(B_C) R22.1
NetD2_2: D2.2(G_C) R21.1
NetD2_4: D2.4(R_C) R20.1
NetR23_2: R23.2 U5.4(INT1/INT)
NetR24_2: R24.2 U5.9(INT2/FSYNC)
NetR25_1: R25.1 U5.1(AP_SDO/AP_AD0)

Not connected (* = marked no-connect by the designer): U5 2(RESV)* 3(RESV)* 10(RESV)* 11(RESV)*

### Notes on the sheet
- RGB LED
- ACCEL/GYRO Sensor
- I2C Address: 0x68
- BUTTON
- /

### Library data of the parts
C29 = C_0603: as C10 on sheet esp32_c6_a1_SoC; Cad Data: ?; Part Number: ?; List Code: ?
C30 C32 = C_0402: as C6 on sheet esp32_c6_a1_SoC; Cad Data: ?; Part Number: ?; List Code: ?
C31 = C_0402: SMD 0402 Ceramic Chip Capacitor; Manufacturer: Samsung; MPN: CL05B103KB5NNNC; Cad Data: ?; Part Number: ?; List Code: ?
D2 = EAST1616RGBA3: Red, Green, Blue (RGB) - LED Indication - Discrete 1.95V Red, 2.8V Green, 2.8V Blue 0606 (1616 Metric); Manufacturer: Everlight Electronics; Check_prices: https://www.snapeda.com/parts/EAST1616RGBA3/Everlight+Electronics+Co+Ltd/view-part/?ref=eda; Value: *; Availability: In Stock; MPN: EAST1616RGBA3; Price: None; Package: 0606 Everlight; SnapEDA_Link: https://www.snapeda.com/parts/EAST1616RGBA3/Everlight+Electronics+Co+Ltd/view-part/?ref=snap; Purchase-URL: https://pricing.snapeda.com/search/part/EAST1616RGBA3/?ref=eda
R20-R22 = R_0402: as R3 on sheet esp32_c6_a1_SoC; Cad Data: ?; Part Number: ?; List Code: ?
R23 R24 = R_0402: as R14 on sheet esp32_c6_a1_power; Cad Data: ?; Part Number: ?; List Code: ?
R25 R26 = R_0402: as R1 on sheet esp32_c6_a1_SoC; Cad Data: ?; Part Number: ?; List Code: ?
SW1 = TL3365AF180QG: Tactile Switch SPST-NO Top Actuated Surface Mount; Manufacturer: E-Switch; MPN: TL3365AF180QG; Check_prices: https://www.snapeda.com/parts/TL3365AF180QG/E-Switch/view-part/?ref=eda; Price: None; SnapEDA_Link: https://www.snapeda.com/parts/TL3365AF180QG/E-Switch/view-part/?ref=snap; Package: None; Value: *; Purchase-URL: https://pricing.snapeda.com/search/part/TL3365AF180QG/?ref=eda; Availability: In Stock
U5 = ICM-42605: Manufacturer: TDK Invensense; Description: Accelerometer, Gyroscope, 6 Axis Sensor I2C, I3C, SPI Output; Package: None; Price: None; Value: *; MPN: ICM-42605; Availability: Unavailable

## Nets that join several sheets
+3V3: esp32_c6_a1_SoC (20 pins), esp32_c6_a1_power (C25.2 C26.2 TP28.1 U4.5), esp32_c6_a1_sensors (9 pins)
+V_BAT: esp32_c6_a1_SoC (R11.2), esp32_c6_a1_power (15 pins)
+V_POWER_IN: esp32_c6_a1_SoC (R6.2), esp32_c6_a1_power (6 pins)
GND: esp32_c6_a1_top (M1.MH0), esp32_c6_a1_SoC (22 pins), esp32_c6_a1_power (36 pins), esp32_c6_a1_sensors (8 pins)
BAT_~{CHG}: esp32_c6_a1_SoC (R4.1 U1.23), esp32_c6_a1_power (R14.1 TP23.1)
BUTTON: esp32_c6_a1_SoC (TP7.1 U1.9), esp32_c6_a1_sensors (C32.1 R26.2 SW1.1 SW1.2)
DRV_FAULTN: esp32_c6_a1_SoC (R2.1 U1.19), esp32_c6_a1_power (R17.2 TP33.1)
ESP32_I2C_SCL: esp32_c6_a1_SoC (R10.1 TP12.1 U1.13), esp32_c6_a1_power (U3.10), esp32_c6_a1_sensors (U5.14)
ESP32_I2C_SDA: esp32_c6_a1_SoC (R9.1 TP11.1 U1.12), esp32_c6_a1_power (U3.9), esp32_c6_a1_sensors (U5.13)
ICM_INT1/INT: esp32_c6_a1_SoC (U1.24), esp32_c6_a1_sensors (R23.1)
ICM_INT2/FSYNC: esp32_c6_a1_SoC (U1.25), esp32_c6_a1_sensors (R24.1)
LED_PWM_BLUE: esp32_c6_a1_SoC (TP15.1 U1.28), esp32_c6_a1_sensors (R22.2)
LED_PWM_GREEN: esp32_c6_a1_SoC (TP14.1 U1.27), esp32_c6_a1_sensors (R21.2)
LED_PWM_RED: esp32_c6_a1_SoC (TP13.1 U1.26), esp32_c6_a1_sensors (R20.2)

## Assembly variants
standart: all parts fitted